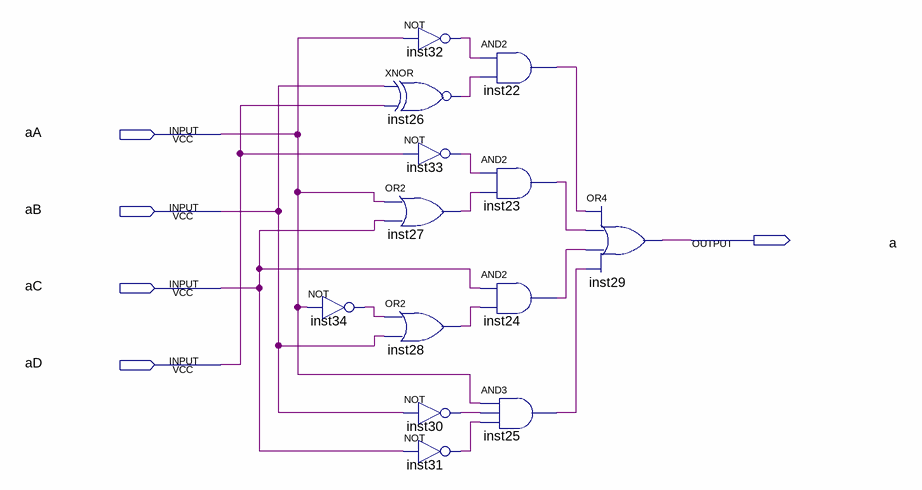
[diagram p0: schematic sheet]
// Quartus schematic segmentoA.bdf as structural Verilog: 13 symbols, 5 pins
module segmentoA (
  input  aA,
  input  aB,
  input  aC,
  input  aD,
  output a
);

  wire inst22_out, inst23_out, inst24_out, inst25_out, inst26_out, inst27_out, inst28_out, inst30_out,
       inst31_out, inst32_out, inst33_out, inst34_out;

  not inst34 (inst34_out, aA);
  not inst32 (inst32_out, aA);
  xnor inst26 (inst26_out, aB, aD);
  not inst33 (inst33_out, aD);
  or inst27 (inst27_out, aA, aC);
  or inst28 (inst28_out, inst34_out, aB);
  not inst30 (inst30_out, aB);
  not inst31 (inst31_out, aC);
  and inst22 (inst22_out, inst32_out, inst26_out);
  and inst23 (inst23_out, inst33_out, inst27_out);
  and inst24 (inst24_out, aC, inst28_out);
  and inst25 (inst25_out, aA, inst30_out, inst31_out);
  or inst29 (a, inst22_out, inst23_out, inst24_out, inst25_out);
endmodule
